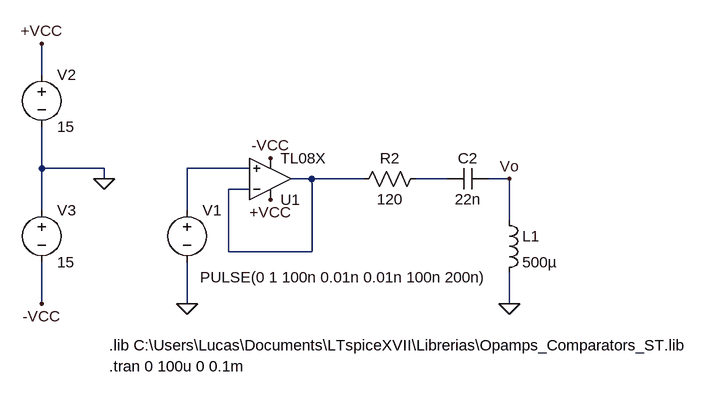
[diagram p0: schematic Pasaaltos.asc]
Pasaaltos.asc, the LTspice schematic file:
Version 4
SHEET 1 880 680
WIRE -288 -64 -288 -112
WIRE -288 80 -288 16
WIRE -192 80 -288 80
WIRE 32 80 -64 80
WIRE -192 96 -192 80
WIRE 128 96 96 96
WIRE 208 96 128 96
WIRE 336 96 288 96
WIRE 432 96 400 96
WIRE 32 112 0 112
WIRE -288 144 -288 80
WIRE -64 144 -64 80
WIRE 432 160 432 96
WIRE 0 208 0 112
WIRE 128 208 128 96
WIRE 128 208 0 208
WIRE -288 288 -288 224
WIRE -64 288 -64 224
WIRE 432 288 432 240
FLAG -64 288 0
FLAG -192 96 0
FLAG -288 -112 +VCC
FLAG -288 288 -VCC
FLAG 432 288 0
FLAG 432 96 Vo
FLAG 64 128 +VCC
FLAG 64 64 -VCC
SYMBOL voltage -64 128 R0
WINDOW 123 0 0 Left 0
WINDOW 39 0 0 Left 0
WINDOW 3 20 119 Left 2
SYMATTR InstName V1
SYMATTR Value PULSE(0 1 100n 0.01n 0.01n 100n 200n)
SYMBOL voltage -288 -80 R0
WINDOW 123 0 0 Left 0
WINDOW 39 0 0 Left 0
SYMATTR InstName V2
SYMATTR Value 15
SYMBOL voltage -288 128 R0
WINDOW 123 0 0 Left 0
WINDOW 39 0 0 Left 0
SYMATTR InstName V3
SYMATTR Value 15
SYMBOL Opamps\\opamp2 64 160 M180
SYMATTR InstName U1
SYMATTR Value TL08X
SYMBOL cap 400 80 R90
WINDOW 0 0 32 VBottom 2
WINDOW 3 32 32 VTop 2
SYMATTR InstName C2
SYMATTR Value 22n
SYMBOL res 304 80 R90
WINDOW 0 0 56 VBottom 2
WINDOW 3 32 56 VTop 2
SYMATTR InstName R2
SYMATTR Value 120
SYMBOL ind 416 144 R0
SYMATTR InstName L1
SYMATTR Value 500µ
TEXT -184 384 Left 2 !.tran 0 100u 0 0.1m
TEXT -184 352 Left 2 !.lib C:\\Users\\Lucas\\Documents\\LTspiceXVII\\Librerias\\Opamps_Comparators_ST.lib

The netlist it stands for:
* Pasaaltos.asc
V1 N001 0 PULSE(0 1 100n 0.01n 0.01n 100n 200n)
V2 +VCC 0 15
V3 0 -VCC 15
XU1 N001 N002 +VCC -VCC N002 TL08X  ; pins In+ In- V+ V- OUT
C2 Vo N003 22n
R2 N003 N002 120
L1 Vo 0 500µ
.tran 0 100u 0 0.1m
.lib C:\Users\Lucas\Documents\LTspiceXVII\Librerias\Opamps_Comparators_ST.lib
.backanno
.end